# Altium schematic sheet Electrical Channels.SchDoc
size A; Engineer: NH; SheetNumber: 3; SheetTotal: 4
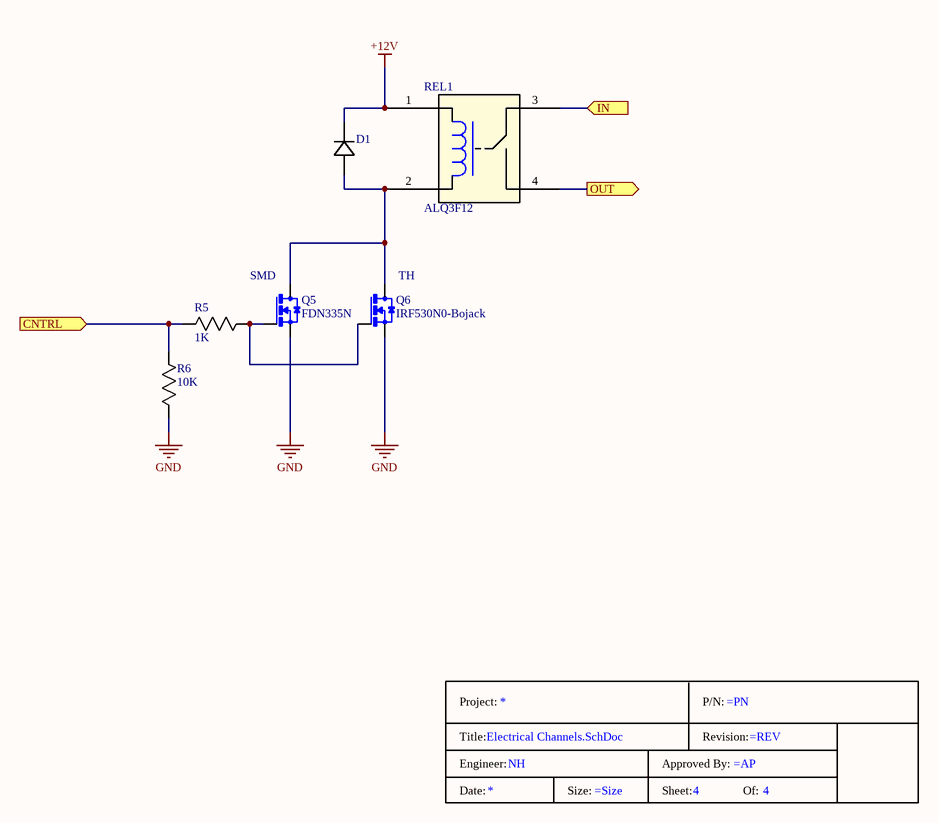
[diagram p0: Electrical Channels.SchDoc]

## Parts
*  Tital_block_1  (value not drawn)  (graphical)
D1  1N5392  [PCBComponent_1]  (value not drawn)
Q5  FDN335N  [ON-SEMI SOT 23]
Q6  IRF530N0-Bojack  [SOT78(TO220AB)]
R5  1K  [R0603]
R6  10K  [R0603]
REL1  ALQ3F12  [ALQ3F12]

## Ports
CNTRL (in), IN (in), OUT (out)

## Nets
+12V: D1.1(C) REL1.1
GND: Q5.2(S) Q6.2(S) R6.1
CNTRL: R5.1 R6.2 ; port CNTRL
IN: REL1.3 ; port IN
OUT: REL1.4 ; port OUT
NetD1_2: D1.2(A) Q5.3(D) Q6.3(D) REL1.2
NetQ5_1: Q5.1(G) Q6.1(G) R5.2

## Notes on the sheet
- (near Q5) SMD
- (near Q6) TH
- (in symbol Tital_block_1) Project:; P/N:; Title:; Revision:; Engineer:; Approved By:; Date:; Size:; Sheet:; Of:

## Library data of the parts
D1 = 1N5392: DIODE STANDARD 100V 1.5A DO204AL; Manufacturer: Vishay General Semiconductor - Diodes Division; Manufacturer P/N: 1N5392-E3/54
Q5 = FDN335N: MOSFET N-CH 20V 1.7A SUPERSOT3; Manufacturer: onsemi; Manufacturer P/N: FDN335N
Q6 = IRF530N0-Bojack: MOSFET N-CH 100V 17A TO220AB; Manufacturer: Bojack; Manufacturer P/N: IRF530N0
R5 = RMCF0603FT1K00: Manufacturer: Stackpole Electronics Inc; Manufacturer P/N: RMCF0603FT1K00
R6 = RMCF0603FT10K0: Manufacturer: Stackpole Electronics Inc; Manufacturer P/N: RMCF0603FT10K0
REL1 = ALQ3F12: Manufacturer: Panasonic Electric Works; ComponentLink1Description: New link; ComponentLink1URL: *; Manufacturer P/N: ALQ3F12